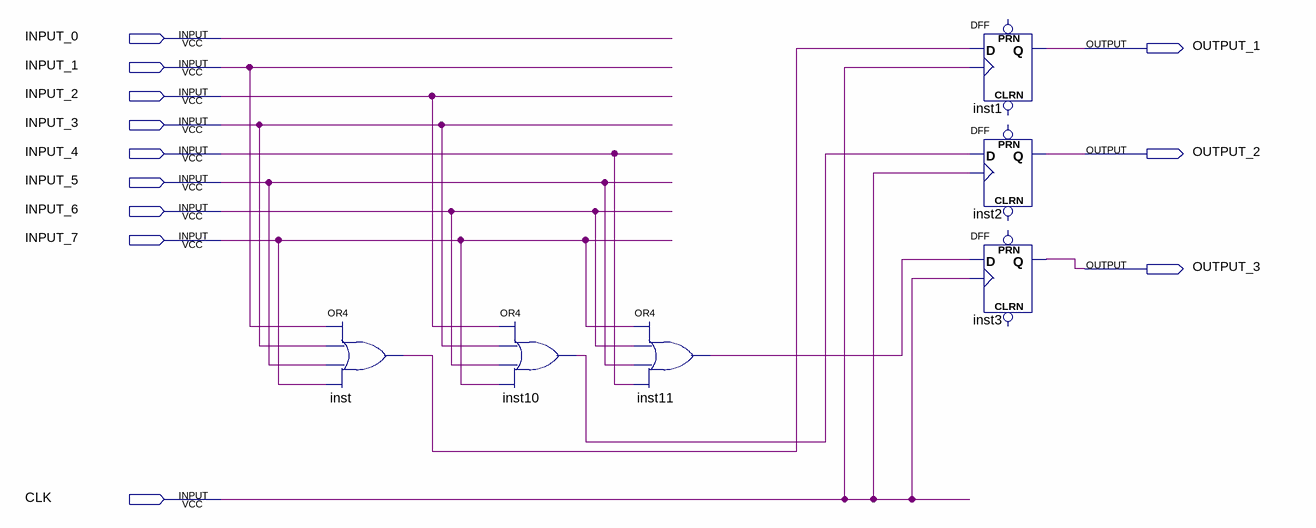
[diagram p0: schematic sheet]
// Quartus schematic Block1.bdf as structural Verilog: 6 symbols, 12 pins
module Block1 (
  input  INPUT_0,
  input  INPUT_1,
  input  INPUT_2,
  input  INPUT_3,
  input  INPUT_4,
  input  INPUT_5,
  input  INPUT_6,
  input  INPUT_7,
  input  CLK,
  output OUTPUT_1,
  output OUTPUT_2,
  output OUTPUT_3
);

  wire inst10_out, inst11_out, inst_out;

  or inst (inst_out, INPUT_1, INPUT_3, INPUT_5, INPUT_7);
  or inst10 (inst10_out, INPUT_2, INPUT_3, INPUT_6, INPUT_7);
  or inst11 (inst11_out, INPUT_7, INPUT_6, INPUT_5, INPUT_4);
  DFF inst1 (.CLK(CLK), .D(inst_out), .Q(OUTPUT_1));  // open: CLRN, PRN
  DFF inst2 (.CLK(CLK), .D(inst10_out), .Q(OUTPUT_2));  // open: CLRN, PRN
  DFF inst3 (.CLK(CLK), .D(inst11_out), .Q(OUTPUT_3));  // open: CLRN, PRN
endmodule
